# Altium project AD8302.PrjPcb
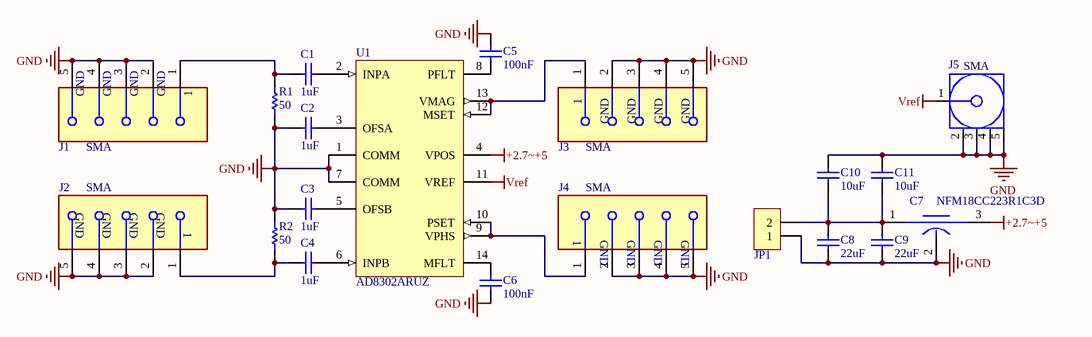
[diagram p0: AD8302.SchDoc]
1 sheet, 20 parts. Net scope: global (net labels, ports and power ports of the same name join across sheets).
Board file: AD8302.PcbDoc

## Sheet AD8302.SchDoc
size A4; SheetNumber: 1; SheetTotal: 1

### Parts
C1  1uF  [0603_C]
C2  1uF  [0603_C]
C3  1uF  [0603_C]
C4  1uF  [0603_C]
C5  100nF  [0603_C]
C6  100nF  [0603_C]
C7  NFM18CC223R1C3D  [FP-NFM18-0_1-e0_15_0_35-MFG]
C8  22uF  [0805_C]
C9  22uF  [0805_C]
C10  10uF  [0603_C]
C11  10uF  [0603_C]
J1  SMA  [FP-SMA-J-P-H-ST-EM1-MFG]
J2  SMA  [FP-SMA-J-P-H-ST-EM1-MFG]
J3  SMA  [FP-SMA-J-P-H-ST-EM1-MFG]
J4  SMA  [FP-SMA-J-P-H-ST-EM1-MFG]
J5  SMA  [TECO-5-1814832-1_V]
JP1  HDR-1X2  [KF2510-LI-2P]  (value not drawn)
R1  50  [RES_MMA0204_3P6X1P4_VIS-L]
R2  50  [RES_MMA0204_3P6X1P4_VIS-L]
U1  AD8302ARUZ  [ADI-RU-14_L]

### Nets
+2.7~+5: C7.3(Output) U1.4(VPOS)
GND: C2.1 C3.1 C5.1 C6.2 C7.2(GND) C8.2 C9.2 C10.1 C11.1 J1.2(MNT_1) J1.3(MNT_2) J1.4(MNT_3) J1.5(MNT_4) J2.2(MNT_1) J2.3(MNT_2) J2.4(MNT_3) J2.5(MNT_4) J3.2(MNT_1) J3.3(MNT_2) J3.4(MNT_3) J3.5(MNT_4) J4.2(MNT_1) J4.3(MNT_2) J4.4(MNT_3) J4.5(MNT_4) J5.2 J5.3 J5.4 J5.5 JP1.1 R1.2 R2.1 U1.1(COMM) U1.7(COMM)
Vref: J5.1 U1.11(VREF)
NetC1_1: C1.1 J1.1 R1.1
NetC1_2: C1.2 U1.2(INPA)
NetC2_2: C2.2 U1.3(OFSA)
NetC3_2: C3.2 U1.5(OFSB)
NetC4_1: C4.1 J2.1 R2.2
NetC4_2: C4.2 U1.6(INPB)
NetC5_2: C5.2 U1.8(PFLT)
NetC6_1: C6.1 U1.14(MFLT)
NetC7_1: C7.1(Input) C8.1 C9.1 C10.2 C11.2 JP1.2
NetJ3_1: J3.1 U1.12(MSET) U1.13(VMAG)
NetJ4_1: J4.1 U1.9(VPHS) U1.10(PSET)

### Notes on the sheet
- (in symbol CMP-02754-000006-1) GND

### Library data of the parts
C1-C6 C8-C11 = CAP: Capacitor; Value: 104; Published: 8-Jun-2000; LatestRevisionDate: 17-Jul-2002; LatestRevisionNote: Re-released for DXP Platform.; PackageReference: RAD-0.3; Publisher: Altium Limited
C7 = CMP-06053-000245-1: Large Current 3 Terminals Low ESL Chip Multilayer Ceramic Capacitors for General Purpose, 0603, 22000pF, 20%, 16V; Frequency: 1kHz; Current: 1A; Insulation Resistance: 1GR; Capacitance: 22nF; DC Resistance (DCR): 50mR; Max Voltage Rating (DC): 16V; Packaging: Tape and Reel; Package Quantity: 1; Voltage Rating: 16V; Min Operating Temperature: -55°C; Voltage Rating (DC): 16V; Width: 0.8mm; Max Current Rating: 1A; Max Operating Temperature: 125°C; Lead Free: Lead Free; Case Code (Metric): 1608; Tolerance: 20%; Mount: Surface Mount; REACH SVHC: No SVHC; Termination: Flat; Voltage: 16V; Height: 0.6mm; Case/Package: 0603; Length: 1.6mm; Radiation Hardening: No; Depth: 0.8mm; Current Rating: 1A; Case Code (Imperial): 0603
J1-J4 = CMP-02754-000006-1: CONN SMA JACK STR 50OHM EDGE MNT; Dielectric Material: PTFE; Center Contact Plating: Gold; Max Frequency: 6GHz; Body Material: Brass; Voltage Rating: 335V; Impedance: 50R; Package Quantity: 1; Case/Package: SMA; Max Operating Temperature: 125°C; Fastening Type: Threaded; Orientation: Straight; Depth: 13.33mm; RoHS Compliant: Yes; Length: 6.35mm; Insulation Material: Polytetrafluoroethylene; Termination: Solder; Min Operating Temperature: -65°C; Housing Color: Gold; Contact Plating: Gold; Contact Material: Copper; Connector Type: SMA; Mount: Edge; Series: SMA; Packaging: Tray; Body Plating: Gold; Radiation Hardening: No
J5 = CMP-2000-05415-1: SMA Connector, Pitch 5.08 mm, 1 Position, Height 9.5 mm, Tail Length 4 mm, -65 to 165 degC, RoHS, Bulk; Manufacturer: TE Connectivity; Connector Mounting: PCBMount; Connector Body Style: StraightJack; Impedance: 50ohm; Coaxial Termination: Solder; SVHC: NoSVHC(15-Jun-2015); Frequency Max: 3GHz; Product Range: ZDCSeries; Connector Type: SMACoaxial; Datasheet Version: Rev. B1, 03/2011; Package Reference: 5-1814832-1; Package Description: SMA Connector, Pitch 5.08 mm, 1 Position, Height 9.5 mm, Tail Length 4 mm; Contact Plating: GoldPlatedContacts; Coaxial Cable Types: -; Contact Material: BerylliumCopper; Manufacturer URL: http://www.te.com/; Datasheet URL: http://www.onlinecomponents.com/productFiles/mf-AMP/eng_cd_1814832_a.pdf
JP1 = Header 2: 2P接插件; 淘宝ID: 小糖豆的小窝窝; BOM名称: 2P接插件; 下单链接: https://item.taobao.com/item.htm?ft=t&id=613637044352
R1 R2 = RES: Resistor; Value: 1K; Published: 8-Jun-2000; Revision: July-2002: Re-released for DXP Platform.; Publisher: Altium Limited
U1 = CMP-0284-00076-1: LF-2.7 GHz RF/IF Gain and Phase Detector, 60ns Response Time, RU-14, Pb-Free, 96 Tube; Voltage Supply (V): 2.7 to 5.5; RF Frequency (MHz): 2700; Dynamic Range (dB): 60dB; Supply Current: 19mA; Temp Stability (dB): 1dB; Product Description: Dual-Channel Gain and Phase Outputs; ComponentLink1URL: www.analog.com; Response Time (ns typ): 60ns; ComponentLink1Description: Manufacturer URL; Code_JEDEC: MO-153AB-1; ComponentLink3URL: http://www.analog.com/static/imported-files/packages/36057385283879153717235186773RU14.pdf; PackageReference: RU-14; PackageVersion: Aug-2002; DatasheetVersion: Rev. A; ComponentLink2URL: http://www.analog.com/static/imported-files/data_sheets/AD8302.pdf; ComponentLink3Description: Package Specification; PackageDescription: 14-Lead Thin Shrink Small Outline Package [TSSOP]; ComponentLink2Description: Datasheet